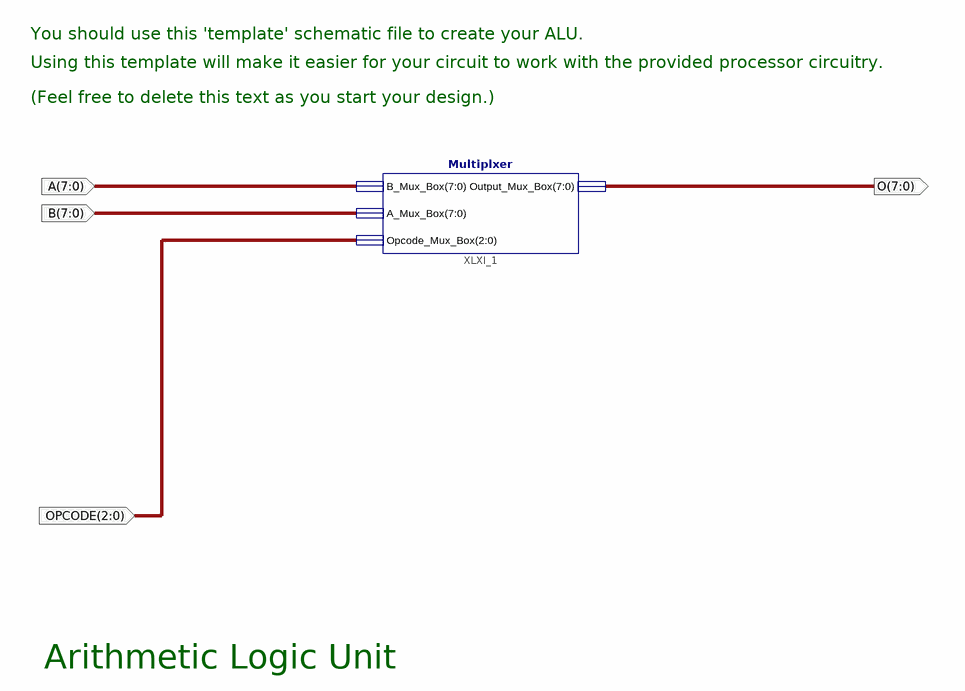
[diagram p0: schematic sheet 1]
// Xilinx ISE schematic ALU.sch (spartan6) as structural Verilog: 1 symbols, 4 ports
module ALU (
  input  [7:0] A,
  input  [7:0] B,
  input  [2:0] OPCODE,
  output [7:0] O
);

  Multiplxer XLXI_1 (.B_Mux_Box(A), .A_Mux_Box(B), .Opcode_Mux_Box(OPCODE), .Output_Mux_Box(O));

  // Notes on the sheet:
  //   You should use this 'template' schematic file to create your ALU.
  //   Using this template will make it easier for your circuit to work with the provided processor circuitry.
  //   (Feel free to delete this text as you start your design.)
  //   Arithmetic Logic Unit
endmodule
